# Altium schematic sheet arduino-to-headers-shield.SchDoc
size A; SheetNumber: 1; SheetTotal: 1
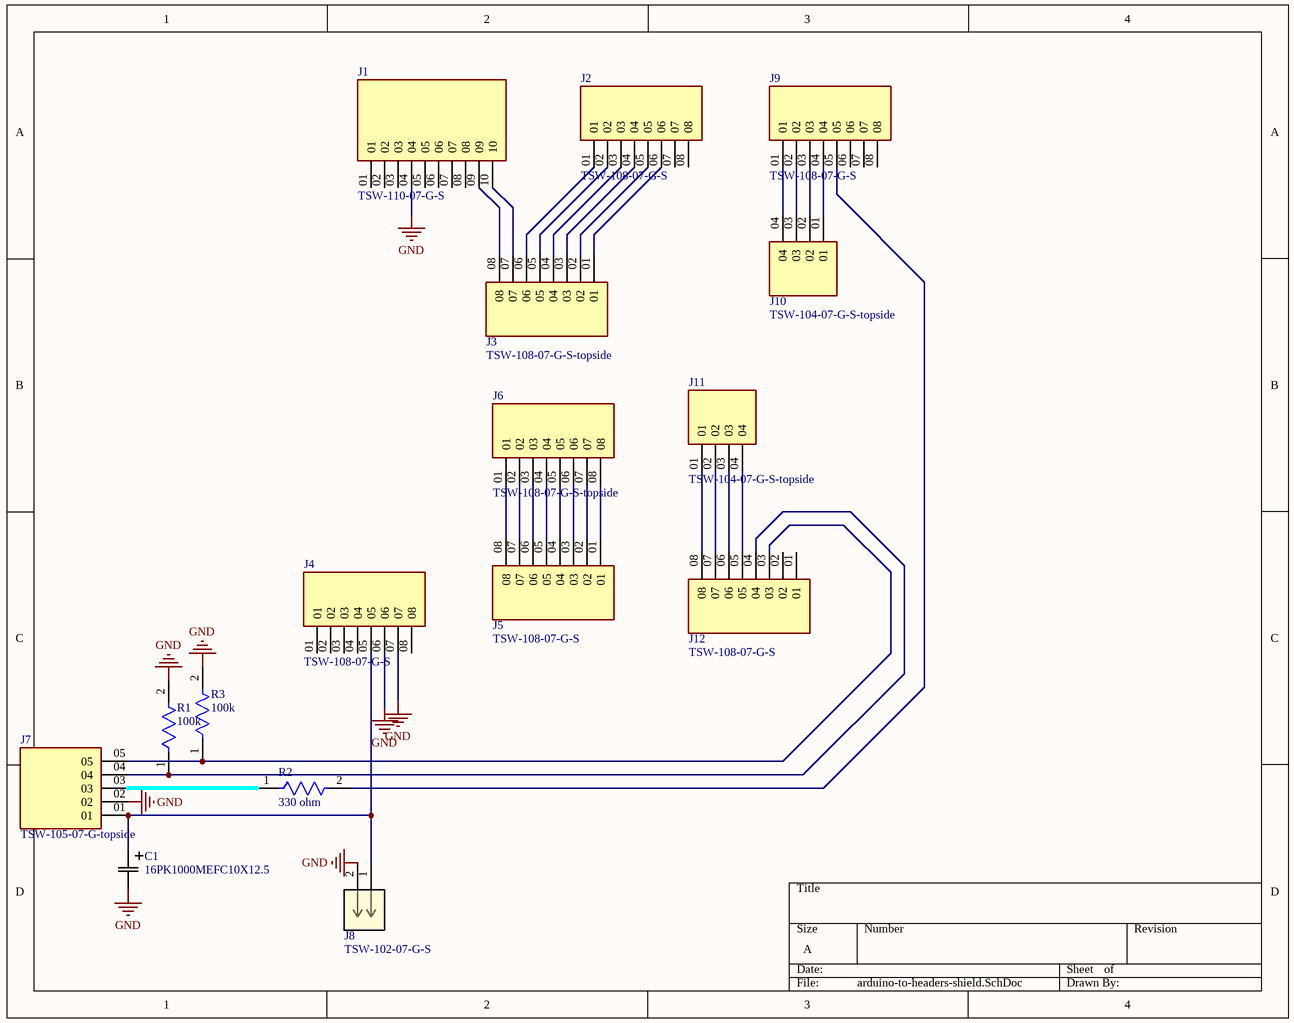
[diagram p0: arduino-to-headers-shield.SchDoc]

## Parts
C1  16PK1000MEFC10X12.5  [CAP_PKPZ_10X12P5_LOW_RUB]
J1  TSW-110-07-G-S  [SAMTEC_TSW-110-07-G-S]
J2  TSW-108-07-G-S  [SAMTEC_TSW-108-07-G-S]
J3  TSW-108-07-G-S-topside  [SAMTEC_TSW-108-07-G-S-topside]
J4  TSW-108-07-G-S  [SAMTEC_TSW-108-07-G-S]
J5  TSW-108-07-G-S  [SAMTEC_TSW-108-07-G-S]
J6  TSW-108-07-G-S-topside  [SAMTEC_TSW-108-07-G-S-topside]
J7  TSW-105-07-G-topside  [SAMTEC_TSW-105-07-G-S-topside]
J8  TSW-102-07-G-S  [TSW-102-07-G-S-topside]
J9  TSW-108-07-G-S  [SAMTEC_TSW-108-07-G-S]
J10  TSW-104-07-G-S-topside  [SAMTEC_TSW-104-07-G-S-topside]
J11  TSW-104-07-G-S-topside  [SAMTEC_TSW-104-07-G-S-topside]
J12  TSW-108-07-G-S  [SAMTEC_TSW-108-07-G-S]
R1  100k  [FP-RLR07-MFG]
R2  330 ohm  [FP-RLR07-MFG]
R3  100k  [FP-RLR07-MFG]

## Nets
GND: C1.2 J1.04 J4.06 J4.07 J7.02 J8.2 R1.2 R3.2
NetC1_1: C1.1 J4.05 J7.01 J8.1
NetJ1_09: J1.09 J3.08
NetJ1_10: J1.10 J3.07
NetJ2_01: J2.01 J3.06
NetJ2_02: J2.02 J3.05
NetJ2_03: J2.03 J3.04
NetJ2_04: J2.04 J3.03
NetJ2_05: J2.05 J3.02
NetJ2_06: J2.06 J3.01
NetJ5_01: J5.01 J6.08
NetJ5_02: J5.02 J6.07
NetJ5_03: J5.03 J6.06
NetJ5_04: J5.04 J6.05
NetJ5_05: J5.05 J6.04
NetJ5_06: J5.06 J6.03
NetJ5_07: J5.07 J6.02
NetJ5_08: J5.08 J6.01
NetJ7_03: J7.03 R2.1
NetJ7_04: J7.04 J12.04 R1.1
NetJ7_05: J7.05 J12.03 R3.1
NetJ9_01: J9.01 J10.04
NetJ9_02: J9.02 J10.03
NetJ9_03: J9.03 J10.02
NetJ9_04: J9.04 J10.01
NetJ9_05: J9.05 R2.2
NetJ11_01: J11.01 J12.08
NetJ11_02: J11.02 J12.07
NetJ11_03: J11.03 J12.06
NetJ11_04: J11.04 J12.05

Not connected (* = marked no-connect by the designer): J1 01 02 03 05 06 07 08; J2 07 08; J4 01 02 03 04 08; J9 06 07 08; J12 01 02

## Library data of the parts
C1 = 16PK1000MEFC10X12.5: No Description Available; Mfr_Name: Rubycon; Type: DEV; Copyright: Copyright (C) 2024 Ultra Librarian. All rights reserved.; Manufacturer_Part_Number: 16PK1000MEFC10X12.5; RefDes: RefDes
J1 = TSW-110-07-G-S: MF: Samtec Inc.; Package: None; Price: None; Value: *; MP: TSW-110-07-G-S; Availability: Unavailable
J2 J4 J5 J9 J12 = TSW-108-07-G-S: TSW - Samtec 2.54mm Pin Header 10.92mm Overall Pin Length (07) - Fast Stock; MF: Samtec Inc.; SnapEDA_Link: https://www.snapeda.com/parts/TSW-108-07-G-S/Samtec+Inc./view-part/?ref=snap; Package: None; Value: *; MP: TSW-108-07-G-S; Check_prices: https://www.snapeda.com/parts/TSW-108-07-G-S/Samtec+Inc./view-part/?ref=eda
J3 J6 = TSW-108-07-G-S-topside: TSW - Samtec 2.54mm Pin Header 10.92mm Overall Pin Length (07) - Fast Stock; MF: Samtec Inc.; SnapEDA_Link: https://www.snapeda.com/parts/TSW-108-07-G-S/Samtec+Inc./view-part/?ref=snap; Package: None; Value: *; MP: TSW-108-07-G-S; Check_prices: https://www.snapeda.com/parts/TSW-108-07-G-S/Samtec+Inc./view-part/?ref=eda
J7 = TSW-105-07-G-topside: MP: TSW-105-07-G-S; MF: Samtec Inc.; Package: None; Price: None; Availability: Unavailable; Value: *
J8 = TSW-102-07-G-S-topside: No Description Available; Mfr_Name: Samtec Inc; Copyright: Copyright (C) 2024 Ultra Librarian. All rights reserved.; Manufacturer_Part_Number: TSW-102-07-G-S; RefDes: RefDes; Type: DEV
J10 J11 = TSW-104-07-G-S-topside: <a href="https://pricing.snapeda.com/parts/TSW-104-07-G-S/Samtec/view-part?ref=eda">Check availability</a>; MP: altium_native_batch; Package: None; Price: None; Value: *; Availability: Unavailable
R1-R3 = CMP-00030-39449004-1: RLR07C1002FSB14 Fixed Resistor, Metal Film, 0.25W, 10000ohm, 250V, 1% +/-Tol, 100ppm/Cel, Through Hole Mount; Power Rating: 250mW; Lead Diameter: 640µm; Wire/Cable Diameter: 50.8µm; Lead Length: 38.1mm; Resistance: 10kΩ; Temperature Coefficient: 100ppm/°C; Military Standard: MIL-PRF-39017; Max Operating Temperature: 150°C; Width: 2.29mm; Mount: Through Hole; Composition: Metal Film; REACH SVHC: Unknown; Tolerance: 1%; Failure Rate: 0.001%; Min Operating Temperature: -65°C; Voltage Rating: 250V; Schedule B: 8533210090, 8533210090; Max Power Dissipation: 250mW; Length: 7.62mm; Case/Package: Conformal; Lead Free: Contains Lead; NexarPartId: 39449004; Radiation Hardening: No; Termination: Axial; Number of Pins: 14; RoHS: Non-Compliant; Packaging: Bulk; Features: Military, Moisture Resistant, Weldable; Number of Terminations: 2; Contact Plating: Lead, Tin; Diameter: 2.29mm; Voltage Rating (DC): 250V